# Altium schematic sheet [01] - COVER PAGE.SchDoc: Vanilla SCB
size A4; Organization: Bjørn T. Brodtkorb; Address1: Frode Rinnans veg 161; Address2: 7050 Trondheim; DocumentNumber: 2; Revision: 1.0; SheetNumber: 2; SheetTotal: 13
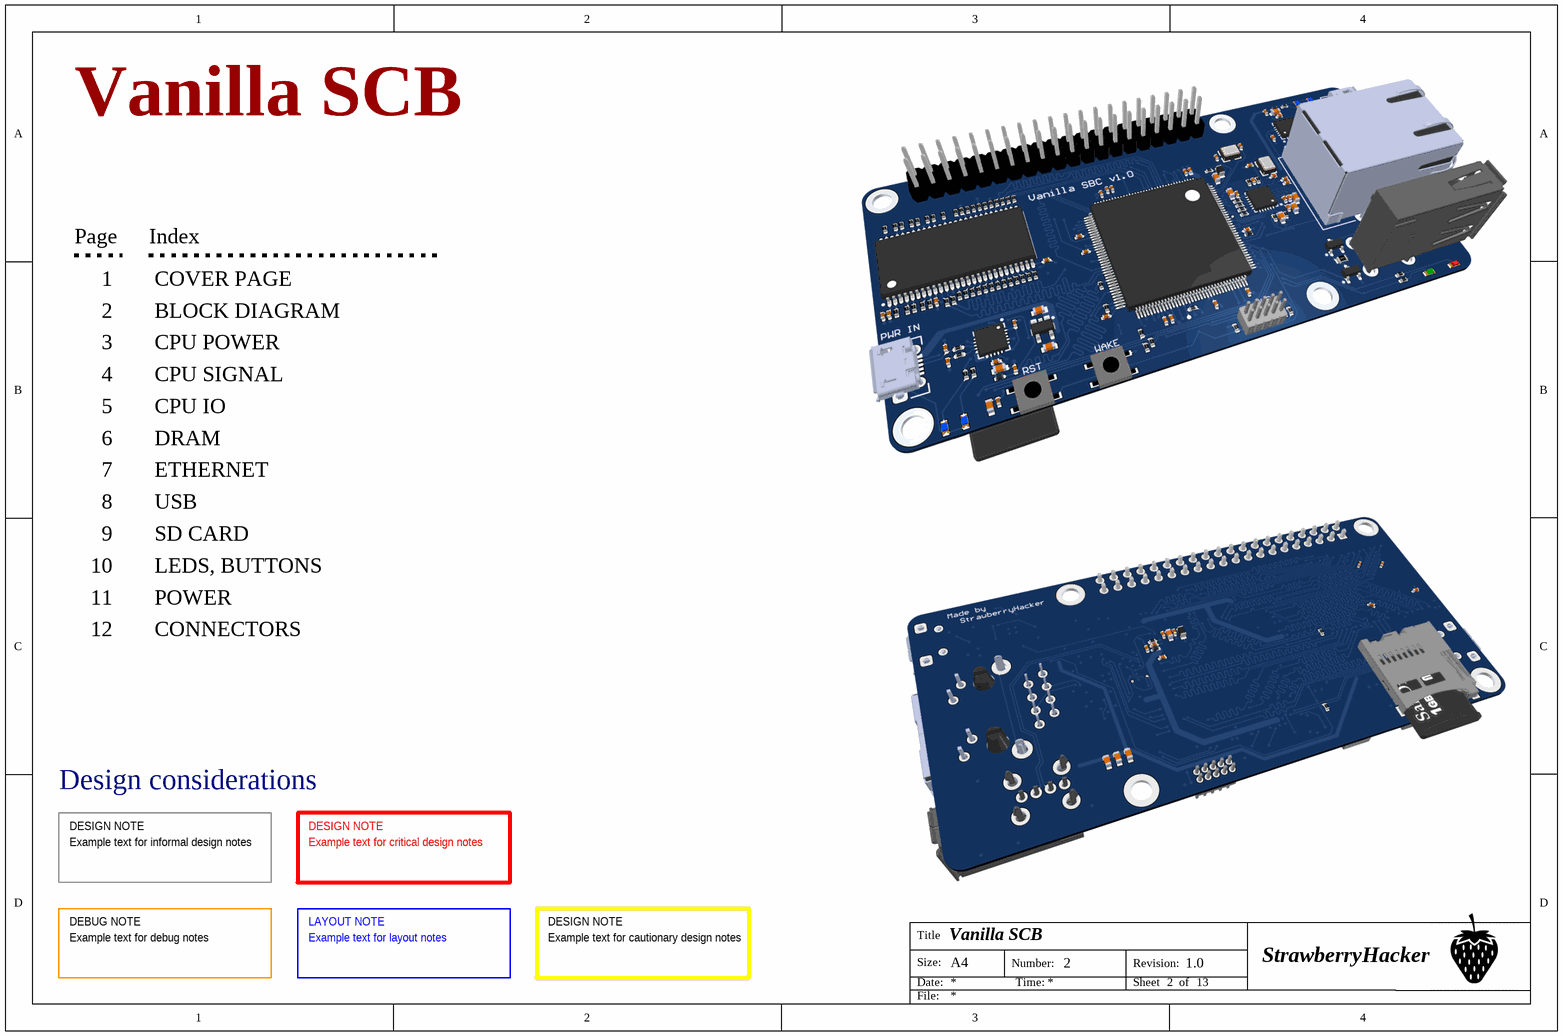
[diagram p0: [01] - COVER PAGE.SchDoc]

## Notes on the sheet
- Vanilla SCB
- Page
- Index
- 1
- COVER PAGE
- Top side
- 2
- 3
- 4
- BLOCK DIAGRAM
- CPU POWER
- CPU SIGNAL
- 5
- 6
- CPU IO
- DRAM
- 7
- 8
- ETHERNET
- USB
- 10
- 9
- SD CARD
- LEDS, BUTTONS
- 11
- 12
- POWER
- CONNECTORS
- Bottom side
- Design considerations
- DESIGN NOTE
- Example text for informal design notes
- Example text for critical design notes
- DEBUG NOTE
- Example text for debug notes
- LAYOUT NOTE
- Example text for layout notes
- Example text for cautionary design notes
- Title
- Size:
- Date:
- A4
- Number:
- Time:
- Revision:
- Sheet
- of
- StrawberryHacker
- File: